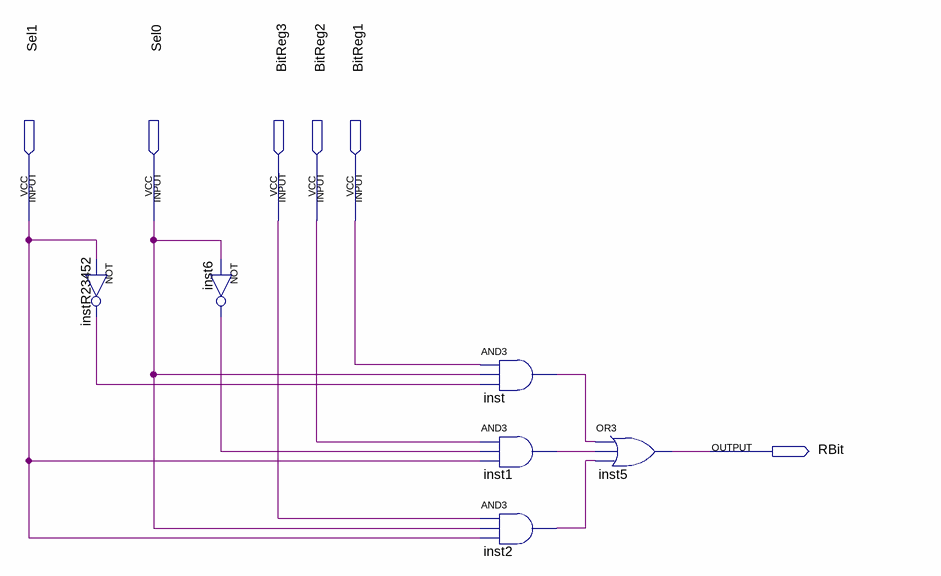
[diagram p0: schematic sheet]
// Quartus schematic Muxzinho.bdf as structural Verilog: 6 symbols, 6 pins
module Muxzinho (
  input  Sel1,
  input  Sel0,
  input  BitReg3,
  input  BitReg2,
  input  BitReg1,
  output RBit
);

  wire inst1_out, inst2_out, inst6_out, inst_out, instR23452_out;

  not instR23452 (instR23452_out, Sel1);
  not inst6 (inst6_out, Sel0);
  and inst (inst_out, BitReg1, Sel0, instR23452_out);
  and inst1 (inst1_out, BitReg2, inst6_out, Sel1);
  and inst2 (inst2_out, BitReg3, Sel0, Sel1);
  or inst5 (RBit, inst_out, inst1_out, inst2_out);
endmodule
